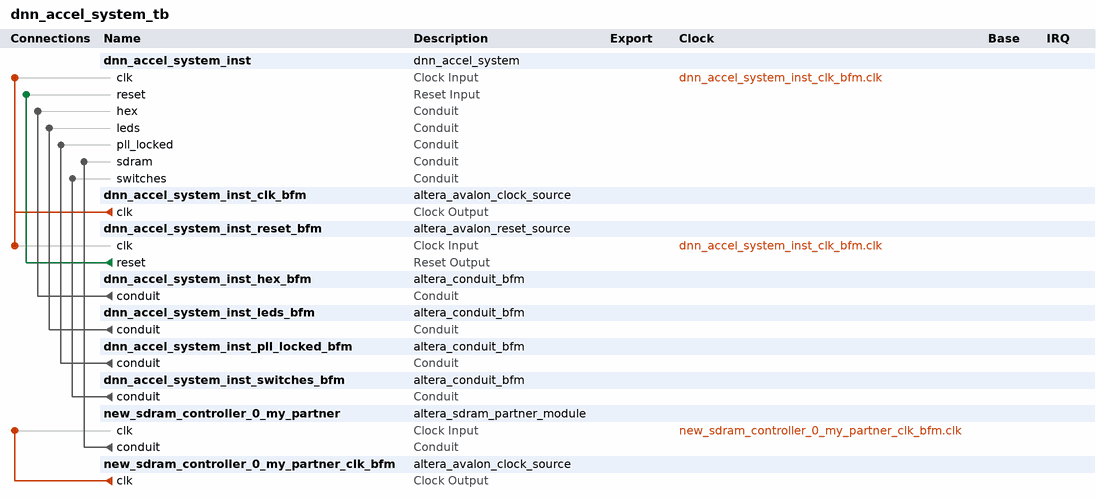
[diagram p0: system contents]
# Platform Designer (Qsys) system dnn_accel_system_tb, Cyclone V 5CSEMA5F31C6
# Parameters at their usual value, and those the tool derives, are not listed.
package require -exact qsys 19.1
create_system dnn_accel_system_tb
set_project_property DEVICE_FAMILY {Cyclone V}
set_project_property DEVICE 5CSEMA5F31C6

add_instance dnn_accel_system_inst dnn_accel_system 1.0

add_instance dnn_accel_system_inst_clk_bfm altera_avalon_clock_source 19.1

add_instance dnn_accel_system_inst_reset_bfm altera_avalon_reset_source 19.1
set_instance_parameter_value dnn_accel_system_inst_reset_bfm ASSERT_HIGH_RESET 0
set_instance_parameter_value dnn_accel_system_inst_reset_bfm INITIAL_RESET_CYCLES 50

add_instance dnn_accel_system_inst_hex_bfm altera_conduit_bfm 19.1
set_instance_parameter_value dnn_accel_system_inst_hex_bfm CLOCKED_SIGNAL false
set_instance_parameter_value dnn_accel_system_inst_hex_bfm ENABLE_RESET false
set_instance_parameter_value dnn_accel_system_inst_hex_bfm SIGNAL_DIRECTIONS input
set_instance_parameter_value dnn_accel_system_inst_hex_bfm SIGNAL_WIDTHS 7

add_instance dnn_accel_system_inst_leds_bfm altera_conduit_bfm 19.1
set_instance_parameter_value dnn_accel_system_inst_leds_bfm CLOCKED_SIGNAL false
set_instance_parameter_value dnn_accel_system_inst_leds_bfm ENABLE_RESET false
set_instance_parameter_value dnn_accel_system_inst_leds_bfm SIGNAL_DIRECTIONS input
set_instance_parameter_value dnn_accel_system_inst_leds_bfm SIGNAL_WIDTHS 8

add_instance dnn_accel_system_inst_pll_locked_bfm altera_conduit_bfm 19.1
set_instance_parameter_value dnn_accel_system_inst_pll_locked_bfm CLOCKED_SIGNAL false
set_instance_parameter_value dnn_accel_system_inst_pll_locked_bfm ENABLE_RESET false
set_instance_parameter_value dnn_accel_system_inst_pll_locked_bfm SIGNAL_DIRECTIONS input
set_instance_parameter_value dnn_accel_system_inst_pll_locked_bfm SIGNAL_WIDTHS 1

add_instance dnn_accel_system_inst_switches_bfm altera_conduit_bfm 19.1
set_instance_parameter_value dnn_accel_system_inst_switches_bfm CLOCKED_SIGNAL false
set_instance_parameter_value dnn_accel_system_inst_switches_bfm ENABLE_RESET false
set_instance_parameter_value dnn_accel_system_inst_switches_bfm SIGNAL_DIRECTIONS output
set_instance_parameter_value dnn_accel_system_inst_switches_bfm SIGNAL_WIDTHS 8

add_instance new_sdram_controller_0_my_partner altera_sdram_partner_module 11.0
set_instance_parameter_value new_sdram_controller_0_my_partner CONTR_NAME dnn_accel_system_new_sdram_controller_0
set_instance_parameter_value new_sdram_controller_0_my_partner SDRAM_COL_WIDTH 10
set_instance_parameter_value new_sdram_controller_0_my_partner SDRAM_DATA_WIDTH 16
set_instance_parameter_value new_sdram_controller_0_my_partner SDRAM_ROW_WIDTH 13

add_instance new_sdram_controller_0_my_partner_clk_bfm altera_avalon_clock_source 19.1

# connections
add_connection dnn_accel_system_inst_clk_bfm.clk dnn_accel_system_inst.clk clock
add_connection dnn_accel_system_inst_clk_bfm.clk dnn_accel_system_inst_reset_bfm.clk clock
add_connection new_sdram_controller_0_my_partner_clk_bfm.clk new_sdram_controller_0_my_partner.clk clock
add_connection dnn_accel_system_inst_reset_bfm.reset dnn_accel_system_inst.reset reset
add_connection dnn_accel_system_inst_hex_bfm.conduit dnn_accel_system_inst.hex conduit
add_connection dnn_accel_system_inst_leds_bfm.conduit dnn_accel_system_inst.leds conduit
add_connection dnn_accel_system_inst_pll_locked_bfm.conduit dnn_accel_system_inst.pll_locked conduit
add_connection dnn_accel_system_inst_switches_bfm.conduit dnn_accel_system_inst.switches conduit
add_connection new_sdram_controller_0_my_partner.conduit dnn_accel_system_inst.sdram conduit

set_interconnect_requirement {$system} qsys_mm.clockCrossingAdapter HANDSHAKE
set_interconnect_requirement {$system} qsys_mm.enableEccProtection FALSE
set_interconnect_requirement {$system} qsys_mm.insertDefaultSlave FALSE
set_interconnect_requirement {$system} qsys_mm.maxAdditionalLatency 1

save_system dnn_accel_system_tb.qsys
